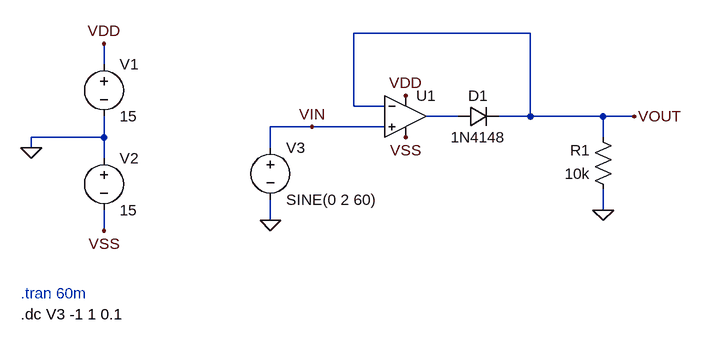
[diagram p0: schematic Lab2Part4Q8.asc]
Lab2Part4Q8.asc, the LTspice schematic file:
Version 4
SHEET 1 1328 680
WIRE 592 48 320 48
WIRE -64 96 -64 64
WIRE 320 160 320 48
WIRE 368 160 320 160
WIRE 480 176 432 176
WIRE 592 176 592 48
WIRE 592 176 544 176
WIRE 704 176 592 176
WIRE 752 176 704 176
WIRE 256 192 192 192
WIRE 368 192 256 192
WIRE -64 208 -64 176
WIRE -64 208 -176 208
WIRE 704 208 704 176
WIRE -176 224 -176 208
WIRE 192 224 192 192
WIRE -64 240 -64 208
WIRE 704 320 704 288
WIRE 192 336 192 304
WIRE -64 352 -64 320
FLAG -176 224 0
FLAG -64 352 VSS
FLAG -64 64 VDD
FLAG 400 208 VSS
FLAG 400 144 VDD
FLAG 192 336 0
FLAG 256 192 VIN
FLAG 704 320 0
FLAG 752 176 VOUT
SYMBOL voltage -64 80 R0
WINDOW 123 0 0 Left 0
WINDOW 39 0 0 Left 0
SYMATTR InstName V1
SYMATTR Value 15
SYMBOL voltage -64 224 R0
WINDOW 123 0 0 Left 0
WINDOW 39 0 0 Left 0
SYMATTR InstName V2
SYMATTR Value 15
SYMBOL OpAmps\\UniversalOpAmp2 400 176 R0
SYMATTR InstName U1
SYMBOL diode 480 192 R270
WINDOW 0 32 32 VTop 2
WINDOW 3 0 32 VBottom 2
SYMATTR InstName D1
SYMATTR Value 1N4148
SYMBOL res 720 304 R180
WINDOW 0 36 76 Left 2
WINDOW 3 36 40 Left 2
SYMATTR InstName R1
SYMATTR Value 10k
SYMBOL voltage 192 208 R0
WINDOW 123 0 0 Left 0
WINDOW 39 0 0 Left 0
SYMATTR InstName V3
SYMATTR Value SINE(0 2 60)
TEXT -192 448 Left 2 ;.tran 60m
TEXT -192 480 Left 2 !.dc V3 -1 1 0.1

The netlist it stands for:
* Lab2Part4Q8.asc
V1 VDD 0 15
V2 0 VSS 15
XU1 VIN VOUT VDD VSS N001 level2 Avol=1Meg GBW=10Meg Slew=10Meg Ilimit=25m Rail=0 Vos=0 En=0 Enk=0 In=0 Ink=0 Rin=500Meg  ; pins In+ In- V+ V- OUT
D1 N001 VOUT 1N4148
R1 0 VOUT 10k
V3 VIN 0 SINE(0 2 60)
.model D D
.lib standard.dio
* .tran 60m
.dc V3 -1 1 0.1
.lib UniversalOpAmp2.lib
.backanno
.end

* Results of the author's LTspice run, read from the files saved beside the schematic
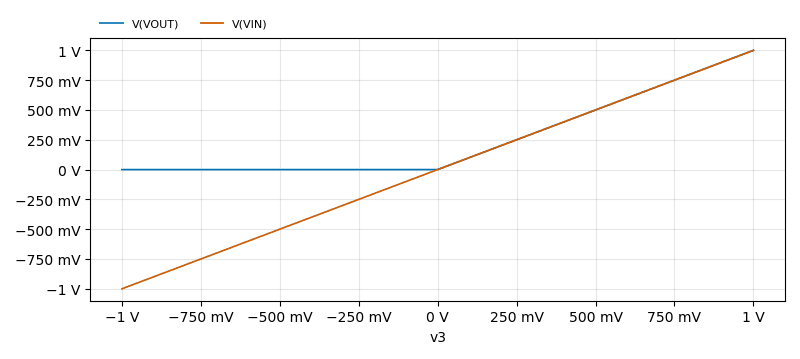
[diagram p1: DC transfer characteristic of Lab2Part4Q8.asc, plotted from the saved traces]
* DC transfer characteristic, 1 run:
*   V(VOUT): -25.35 µV at v3=-1 V, 1 V at v3=1 V, min -25.35 µV, max 1 V
*   V(VIN): -1 V at v3=-1 V, 1 V at v3=1 V, min -1 V, max 1 V